# Altium schematic sheet step-up.SchDoc
size A
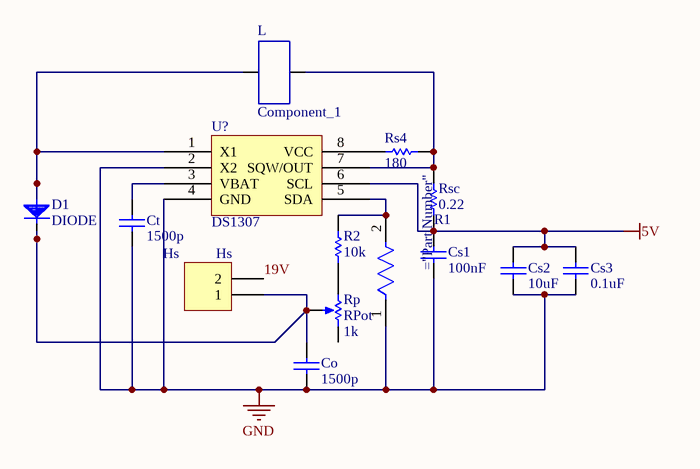
[diagram p0: step-up.SchDoc]

## Parts
Co  value 1500p  [CC2012-0805]  (hidden comment: Cap-NP)
Cs1  value 100nF  [CC2012-0805]  (hidden comment: Cap-NP)
Cs2  value 10uF  [CC2012-0805]  (hidden comment: Cap-NP)
Cs3  value 0.1uF  [CC2012-0805]  (hidden comment: Cap-NP)
Ct  value 1500p  [CC2012-0805]  (hidden comment: Cap-NP)
D1  DIODE  [D1N40XX]
Hs  Hs  [HDR1X2]
L  Component_1  [PCBComponent_1]
R1  ERJ-A1BJ1R2U  [Panasonic_ERJ-A1BJ1R2U_0]  (value not drawn)
R2  value 10k  [R5W]  (hidden comment: Res)
Rp  RPot  value 1k  [VR_MUL-V]
Rs4  value 180  [CC2012-0805]  (hidden comment: Res)
Rsc  value 0.22  [CC2012-0805]  (hidden comment: Res)
U?  DS1307  [DIP8L]

## Nets
5V: Cs1.2 Cs2.1 Cs3.1 Rsc.1 U?.6(SCL)
GND: Co.1 Cs1.1 Cs2.2 Cs3.2 Ct.1 R1.1 U?.2(X2) U?.4(GND)
19V: Hs.2
NetCo_2: Co.2 D1.1(K) Hs.1 Rp.2(TAP)
NetCt_2: Ct.2 U?.3(VBAT)
NetD1_2: D1.2(a) L.1 U?.1(X1)
NetL_2: L.2 Rs4.2 Rsc.2 U?.7(SQW/OUT)
NetR1_2: R1.2 R2.2 U?.5(SDA)
NetR2_1: R2.1 Rp.1(TOP)
NetRs4_1: Rs4.1 U?.8(VCC)

Not connected (* = marked no-connect by the designer): Rp 3(BOT)

## Library data of the parts
Co Cs1-Cs3 Ct = Cap-NP: Capacitor; Manufacturer: Generic Components; Class I: Passive; Published: 8-Jun-2000; Revision: July-2002: Re-released for DXP Platform.; Publisher: Altium Limited; Class II: Capacitor
Hs = Header 2: Header, 2-Pin; LatestRevisionDate: 17-Jul-2002; LatestRevisionNote: Re-released for DXP Platform.; Publisher: Altium Limited
L = Component_1: power inductor
R2 Rs4 Rsc = Res: Resistor; Manufacturer: Generic Components; Class I: Passive; Published: 8-Jun-2000; Revision: July-2002: Re-released for DXP Platform.; Publisher: Altium Limited; Class II: Resistor
Rp = RPot: Potentiometer; Manufacturer: Generic Components; Class I: Passive; Set Position: 0.5; Published: 8-Jun-2000; Revision: July-2002: Re-released for DXP Platform.; Publisher: Altium Limited; Class II: Potentiometer